# Altium project DroneProject.PrjPCB
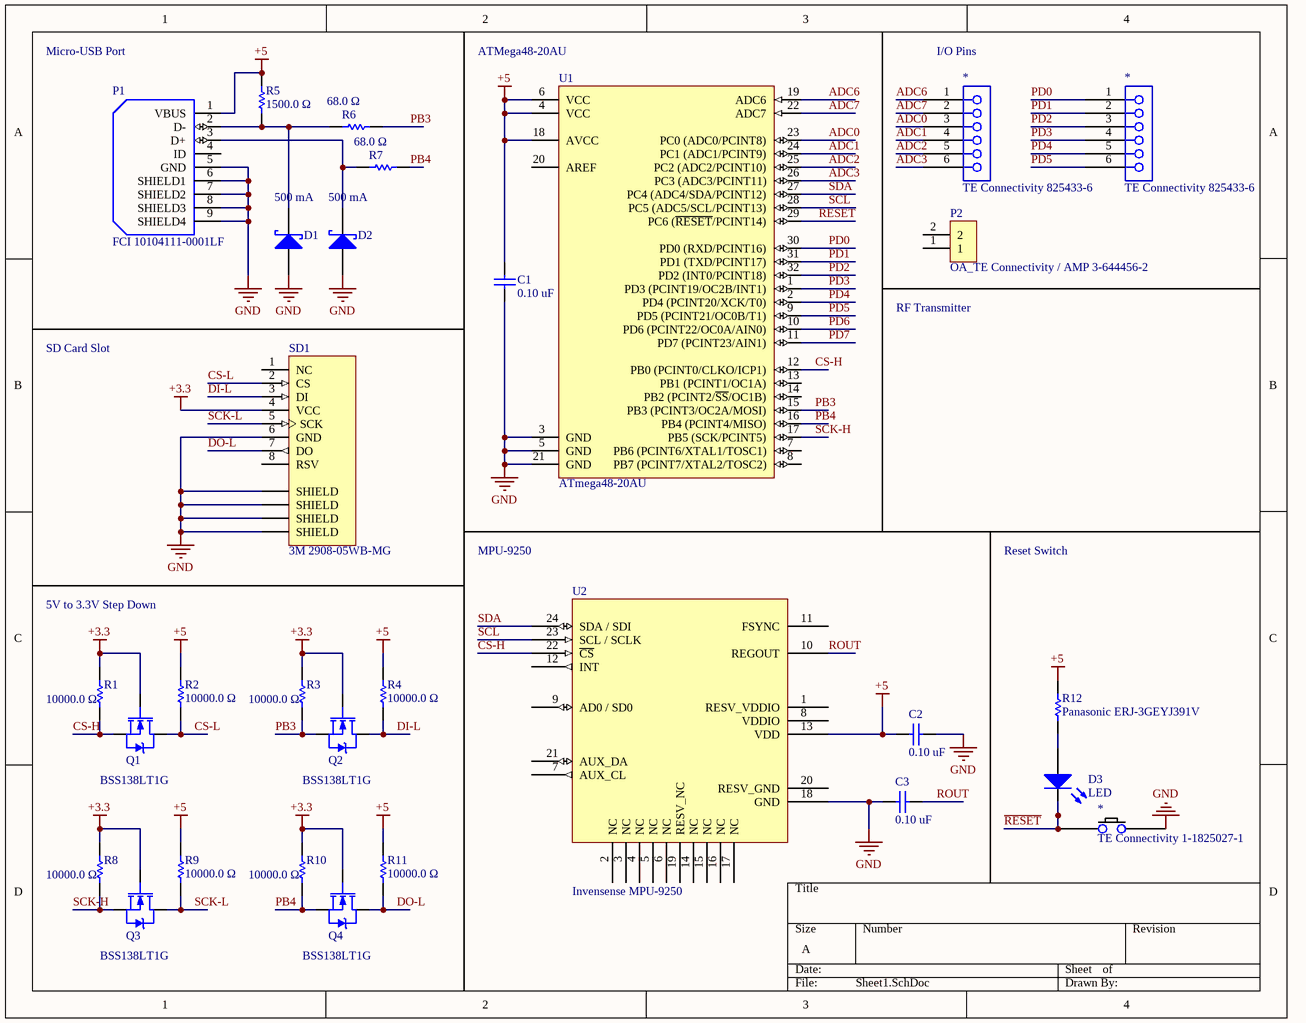
[diagram p0: Sheet1.SchDoc]
1 sheet, 30 parts. Net scope: global (net labels, ports and power ports of the same name join across sheets).
Board file: PCB1.PcbDoc

## Sheet Sheet1.SchDoc
size A

### Parts
(Parts that share a designator on the sheet are numbered #1, #2 ... from top to bottom, then left to right.)
*#1  TE Connectivity 825433-6  [PCB-2xrknp0frdgvb29ud8aa-1]
*#2  TE Connectivity 825433-6  [PCB-2xrknp0frdgvb29ud8aa-1]
*#3  TE Connectivity 1-1825027-1  [PCB-z0tn1x4l8qb5b43a6q2n-1]
C1  Capacitance: 0.10 uF  [CAPC1608X90X35NL15T15]  (hidden comment: AVX Interconnect / Elco 0603YC104JAT2A)
C2  Capacitance: 0.10 uF  [CAPC1608X90X35NL15T15]  (hidden comment: AVX Interconnect / Elco 0603YC104JAT2A)
C3  Capacitance: 0.10 uF  [CAPC1608X90X35NL15T15]  (hidden comment: AVX Interconnect / Elco 0603YC104JAT2A)
D1  Current Rating: 500 mA  [PCB-6tqbiewd2diqb4h5r69p-1]  (hidden comment: Diodes Inc. B0540WS-7)
D2  Current Rating: 500 mA  [PCB-6tqbiewd2diqb4h5r69p-1]  (hidden comment: Diodes Inc. B0540WS-7)
D3  LED  [PCB-rv0a2x7hhpgrq2idocfg-1]
P1  FCI 10104111-0001LF  [FCI-USB-4SHLD_AP8604]
P2  OA_TE Connectivity / AMP 3-644456-2  [PCB-5yupddsicqn8qq7gr5lb-1]
Q1  Manufacturer Part Number: BSS138LT1G  [SOT23-3_B]  (hidden comment: ON Semiconductor BSS138LT1G)
Q2  Manufacturer Part Number: BSS138LT1G  [SOT23-3_B]  (hidden comment: ON Semiconductor BSS138LT1G)
Q3  Manufacturer Part Number: BSS138LT1G  [SOT23-3_B]  (hidden comment: ON Semiconductor BSS138LT1G)
Q4  Manufacturer Part Number: BSS138LT1G  [SOT23-3_B]  (hidden comment: ON Semiconductor BSS138LT1G)
R1  Resistance: 10000.0 Ω  [RESC1609X50X30ML10T20]  (hidden comment: Vishay Dale CRCW060310K0FKEB)
R2  Resistance: 10000.0 Ω  [RESC1609X50X30ML10T20]  (hidden comment: Vishay Dale CRCW060310K0FKEB)
R3  Resistance: 10000.0 Ω  [RESC1609X50X30ML10T20]  (hidden comment: Vishay Dale CRCW060310K0FKEB)
R4  Resistance: 10000.0 Ω  [RESC1609X50X30ML10T20]  (hidden comment: Vishay Dale CRCW060310K0FKEB)
R5  Resistance: 1500.0 Ω  [RESC1609X50X30LL10T20]  (hidden comment: Vishay Dale CRCW06031K50JNEA)
R6  Resistance: 68.0 Ω  [RESC1608X55X30LL15T15]  (hidden comment: Panasonic ERJ-3GEYJ680V)
R7  Resistance: 68.0 Ω  [RESC1608X55X30LL15T15]  (hidden comment: Panasonic ERJ-3GEYJ680V)
R8  Resistance: 10000.0 Ω  [RESC1609X50X30ML10T20]  (hidden comment: Vishay Dale CRCW060310K0FKEB)
R9  Resistance: 10000.0 Ω  [RESC1609X50X30ML10T20]  (hidden comment: Vishay Dale CRCW060310K0FKEB)
R10  Resistance: 10000.0 Ω  [RESC1609X50X30ML10T20]  (hidden comment: Vishay Dale CRCW060310K0FKEB)
R11  Resistance: 10000.0 Ω  [RESC1609X50X30ML10T20]  (hidden comment: Vishay Dale CRCW060310K0FKEB)
R12  Panasonic ERJ-3GEYJ391V  [RESC1608X55X30LL15T15]
SD1  3M 2908-05WB-MG  [MICRO-SD-SOCKET-PP]
U1  ATmega48-20AU  [32A_L]
U2  Invensense MPU-9250  [PCB-14871381-2]

### Nets
+3.3: Q1.1(G) Q2.1(G) Q3.1(G) Q4.1(G) R1.2 R3.2 R8.2 R10.2 SD1.4(VCC)
+5: C1.2 C2.2 P1.1(VBUS) R2.2 R4.2 R5.2 R9.2 R11.2 R12.2 U1.4(VCC) U1.6(VCC) U1.18(AVCC) U2.13(VDD)
GND: *#3.2 C1.1 C2.1 C3.1 D1.2(A) D2.2(A) P1.5(GND) P1.6(SHIELD1) P1.7(SHIELD2) P1.8(SHIELD3) P1.9(SHIELD4) SD1.6(GND) SD1.CD1(SHIELD) SD1.CD2(SHIELD) SD1.GND1(SHIELD) SD1.GND3(SHIELD) U1.3(GND) U1.5(GND) U1.21(GND) U2.18(GND)
ADC0: *#1.3 U1.23(PC0_(ADC0/PCINT8))
ADC1: *#1.4 U1.24(PC1_(ADC1/PCINT9))
ADC2: *#1.5 U1.25(PC2_(ADC2/PCINT10))
ADC3: *#1.6 U1.26(PC3_(ADC3/PCINT11))
ADC6: *#1.1 U1.19(ADC6)
ADC7: *#1.2 U1.22(ADC7)
CS-H: Q1.2(S) R1.1 U1.12(PB0_(PCINT0/CLKO/ICP1)) U2.22(~{CS})
CS-L: Q1.3(D) R2.1 SD1.2(CS)
DI-L: Q2.3(D) R4.1 SD1.3(DI)
DO-L: Q4.3(D) R11.1 SD1.7(DO)
PB3: Q2.2(S) R3.1 R6.2 U1.15(PB3_(PCINT3/OC2A/MOSI))
PB4: Q4.2(S) R7.2 R10.1 U1.16(PB4_(PCINT4/MISO))
PD0: *#2.1 U1.30(PD0_(RXD/PCINT16))
PD1: *#2.2 U1.31(PD1_(TXD/PCINT17))
PD2: *#2.3 U1.32(PD2_(INT0/PCINT18))
PD3: *#2.4 U1.1(PD3_(PCINT19/OC2B/INT1))
PD4: *#2.5 U1.2(PD4_(PCINT20/XCK/T0))
PD5: *#2.6 U1.9(PD5_(PCINT21/OC0B/T1))
PD6: U1.10(PD6_(PCINT22/OC0A/AIN0))
PD7: U1.11(PD7_(PCINT23/AIN1))
~{RESET}: *#3.1 D3.2(K) U1.29(PC6_(~{RESET}/PCINT14))
ROUT: C3.2 U2.10(REGOUT)
SCK-H: Q3.2(S) R8.1 U1.17(PB5_(SCK/PCINT5))
SCK-L: Q3.3(D) R9.1 SD1.5(SCK)
SCL: U1.28(PC5_(ADC5/SCL/PCINT13)) U2.23(SCL_/_SCLK)
SDA: U1.27(PC4_(ADC4/SDA/PCINT12)) U2.24(SDA_/_SDI)
NetD1_1: D1.1(K) P1.2(D-) R5.1 R6.1
NetD2_1: D2.1(K) P1.3(D+) R7.1
NetD3_1: D3.1(A) R12.1

Not connected (* = marked no-connect by the designer): P1 4(ID); P2 1 2; SD1 1(NC) 8(RSV); U1 7(PB6_(PCINT6/XTAL1/TOSC1)) 8(PB7_(PCINT7/XTAL2/TOSC2)) 13(PB1_(PCINT1/OC1A)) 14(PB2_(PCINT2/~{SS}/OC1B)) 20(AREF); U2 1(RESV_VDDIO) 2(NC) 3(NC) 4(NC) 5(NC) 6(NC) 7(AUX_CL) 8(VDDIO) 9(AD0_/_SD0) 11(FSYNC) 12(INT) 14(NC) 15(NC) 16(NC) 17(NC) 19(RESV_NC) 20(RESV_GND) 21(AUX_DA)

### Notes on the sheet
- Micro-USB Port
- (near U1) ATMega48-20AU
- (near *#1) I/O Pins
- SD Card Slot
- RF Transmitter
- MPU-9250
- Reset Switch
- 5V to 3.3V Step Down

### Library data of the parts
*#1 *#2 = 825433-6: Conn Unshrouded Header HDR 6 POS 2.54mm Solder ST Thru-Hole; Pin Pitch: 0.00254 m; Current Rating: 3.0 A; Number of Contacts: 6; ELV Compliant: Compliant; Gender: Male; Housing Color: Green; Contact Plating: Gold, Gold over Nickel, Tin, Tin over Nickel; Mounting Style: PCB; Orientation: Vertical; Packaging: Box; Housing Material: Polyester; RoHS: Compliant; REACH SVHC Compliance: No SVHC; Flammability Rating: UL 94 V-0; Contact Material: Brass; Manufacturer Part Number: 825433-6; OctopartID: 88ed4362af17572a; Lifecycle Status: Active; Octopart URL: http://octopart.com/825433-6-te+connectivity-42271388
*#3 = 1-1825027-1: Switch Push Button OFF (ON) SPST Round Button 0.05A 24VDC Momentary Contact PC Pins Thru-Hole; ELV Compliant: Compliant; Lead-Free Status: Lead Free; Mounting Style: Through Hole; Packaging: Bag; Manufacturer Part Number: 1-1825027-1; Octopart URL: http://octopart.com/1-1825027-1-te+connectivity-42270326; Lifecycle Status: Active; RoHS: Compliant; OctopartID: 4d86860896969241; Contact Material: Copper Alloy
C1-C3 = CMP-19299424-3: CAP CER 0.1UF 16V 5% X7R 0603; Dielectric Material: Ceramic Multilayer; Lead-Free Status: Lead Free; Voltage Rating (DC): 16.0 V; Insulation Resistance: 1e+11 Ω; REACH SVHC Compliance: No SVHC; Mounting Style: Surface Mount; Number of Pins: 2; Size-Width: 0.0008128 m; RoHS: Compliant; Size-Height: 0.00086 m; Case/Package: 0603; Size-Length: 0.0016002 m; Octopart Url: https://octopart.com/0603yc104jat2a-avx+interconnect+%2F+elco-39513099; Capacitance Tolerance: ±5%; OctopartID: 520599559b688dc2; Dielectric Characteristic: X7R
D1 D2 = CMP-992e5020441546e9-1: B0540WS Series 40 V 0.5 A Schottky Barrier Rectifier Surface Mount - SOD-323; Lead-Free Status: Lead Free; Output Current: 500 mA (max); Polarity: Standard; Voltage Rating (DC): 40.0 V; Capacitance: 125 pF; Mounting Style: Surface Mount; Octopart URL: http://octopart.com/b0540ws-7-diodes+inc.-325725; Case/Package: SOD-323; Packaging: Cut Tape (CT), Tape & Reel (TR); RoHS: Compliant; Number of Pins: 2; Manufacturer Part Number: B0540WS-7; Lifecycle Status: Active; REACH SVHC Compliance: No SVHC; OctopartID: 992e5020441546e9
D3 = HSMH-C170: LED; SMD; 0805; red; 7.2-17mcd; 2x1.25x0.8mm; 170°; 1.8÷2.6V; 20mA
P1 = 10104111-0001LF: Conn USB Type A/B RCP 5 POS 0.65mm Solder RA SMD 5 Terminal 1 Port T/R; Gender: Female; Number of Contacts: 5; OctopartID: c7b40fa1d6b01873; Mounting Style: Surface Mount; Seller Landing  Url: https://octopart-clicks.com/click/track?country=US&ak=8157f166&sig=0e93c97&sid=5489&ppid=18822242&vpid=43983423&ct=offers; Contact Plating: Gold; Orientation: Right Angle; REACH SVHC Compliance: No SVHC; Contact Material: Copper Alloy; Octopart Url: http://octopart.com/10104111-0001lf-fci-18822242; RoHS: Compliant; Manufacturer Part Number: 10104111-0001LF
P2 = 3-644456-2: Connector Unshrouded Header HDR 2 Position 2.54mm Solder Straight Thru-Hole; Voltage Rating (AC): 250 V; ELV Compliant: Compliant; Lead-Free Status: Lead Free; Number of Positions: 2; Mounting Angle: 180 °; Gender: Male; Shrouded: No; Octopart URL: http://octopart.com/3-644456-2-te+connectivity+%2F+amp-39514699; Contact Material: Copper Alloy; Housing Material: Polyester; Contact Plating: Tin; RoHS: Compliant; Lifecycle Status: Active; OctopartID: c1ea0aba16c71e2d; Pin Pitch: 2.54 mm; Size-Width: 2.34 mm; Number of Rows: 1; Number of Contacts: 2; Manufacturer Part Number: 3-644456-2; Size-Height: 2.54 mm; Housing Color: Natural; Mounting Style: Through Hole; Size-Length: 4.78 mm; Flammability Rating: UL 94 V-0; Packaging: Box, Bag; Orientation: Vertical
Q1-Q4 = CMP-830104-18: BSS138L: Small Signal MOSFET 50V 200mA 3.5 Ohm Single N-Channel SOT-23 Logic Level; Drain to Source Voltage (Vds): 50.0 V; Breakdown Voltage [Gate to Source]: -20.0 V to 20.0 V; Power Dissipation: 225 mW; Input Capacitance: 50.0 pF; Drain to Source Resistance (on) (Rds): 3.50 Ω; Lead-Free Status: Lead Free; Seller Landing  Url: https://octopart-clicks.com/click/track?country=US&ak=8157f166&sig=018e50f&sid=2402&ppid=5035&vpid=22035692&ct=offers; Packaging: Tape & Reel (TR), Cut Tape (CT); Octopart Url: http://octopart.com/bss138lt1g-on+semiconductor-5035; Lifecycle Status: Active; Current Rating: 200 mA; Voltage Rating (DC): 50.0 V; Number of Pins: 3; REACH SVHC Compliance: No SVHC; Breakdown Voltage (Drain to Source): 50.0 V; Continuous Drain Current (Ids): 200 mA; Mounting Style: Surface Mount; Case/Package: SOT-23; OctopartID: 1270db7a24bdcdb7; Polarity: N-Channel; RoHS: Compliant; Halogen Free Status: Halogen Free
R1-R4 R8-R11 = CMP-2823404-2: Res Thick Film 0603 10K Ohm 1% 0.1W(1/10W) ±100ppm/C Molded SMD Automotive Paper T/R; Lead-Free Status: Lead Free; Voltage Rating (DC): 75.0 V; Case/Package: 0603; Number of Pins: 2; Octopart Url: https://octopart.com/crcw060310k0fkeb-vishay-42465018; OctopartID: a8d6635b7b4a7711; Packaging: Cut Tape (CT); Power Rating: 0.1 W; Resistance Tolerance: ±1%; RoHS: Compliant
R5 = CMP-1856103-2: RES SMD 1.5K OHM 5% 1/10W 0603; Lead-Free Status: Lead Free; Power Rating: 0.1 W; Temperature Coefficient: 200.0 ppm/°C; Voltage Rating (DC): 75.0 V; Case/Package: 0603; Mounting Style: Surface Mount; Number of Pins: 2; Octopart Url: https://octopart.com/crcw06031k50jnea-vishay-39435173; OctopartID: 26f3eda0b830f934; Packaging: Cut Tape (CT); Resistance Tolerance: ±5%; RoHS: Compliant; Size-Height: 0.00045 m; Size-Length: 0.00155 m; Size-Width: 0.00085 m
R6 R7 = CMP-3708367-2: RES SMD 68 OHM 5% 1/10W 0603; Lead-Free Status: Lead Free; Power Rating: 0.1 W; Voltage Rating (DC): 75.0 V; Case/Package: 0603; Lifecycle Status: Not Listed by Manufacturer; Mounting Style: Surface Mount; Octopart Url: https://octopart.com/erj-3geyj680v-panasonic-55422139; OctopartID: a4166e512dcb7bd1; Packaging: Cut Tape (CT); REACH SVHC Compliance: No SVHC; Resistance Tolerance: ±5%; RoHS: Compliant; Size-Height: 0.00045 m; Size-Length: 0.0016 m; Size-Width: 0.0008 m
R12 = ERJ-3GEYJ391V: Thick Film Resistors - SMD 0603 390ohms 5% Tol; Lead-Free Status: Lead Free; Power Rating: 0.1 W; Resistance: 390.0 Ω; Voltage Rating (DC): 75.0 V; Case/Package: 0603; Lifecycle Status: Not Listed by Manufacturer; Mounting Style: Surface Mount; Octopart Url: https://octopart.com/erj-3geyj391v-panasonic-55422096; OctopartID: bc667621359063a1; Packaging: Cut Tape (CT); REACH SVHC Compliance: No SVHC; Resistance Tolerance: ±5%; RoHS: Compliant; Size-Height: 0.00045 m; Size-Length: 0.0016 m; Size-Width: 0.0008 m
SD1 = 2908-05WB-MG: CONN EJECT MICROSD PUSH-PUSH SMD; Lead-Free Status: Lead Free; Number of Contacts: 8; Pin Pitch: 0.0010922 m; Contact Material: Copper; Mounting Style: Surface Mount; Number of Positions: 8; Octopart Url: https://octopart.com/2908-05wb-mg-3m-655983; OctopartID: 2fa0e6a008a9f067; Packaging: Cut Tape (CT); REACH SVHC Compliance: No SVHC; RoHS: Compliant; Size-Height: 0.00185 m; Size-Length: 0.00185 m; Size-Width: 0.014 m
U1 = ATMEGA48-20AU: 8-bit AVR Microcontroller, 2.7-5.5V, 20MHz, 4KB Flash, 256 Bytes EEPROM, 512 Bytes SRAM, 32-pin TQFP, Industrial Grade (-40°C to 85°C); Access Time: 2e-05 s; Clock Speed: 20000000.0 Hz; FLASH Memory Size: 4096 B; Lead-Free Status: Lead Free; Number of Bits: 8; Number of I/O Pins: 23; RAM Memory Size: 512 B; Supply Voltage (DC): 5.0 V; Case/Package: TQFP; Core Architecture: AVR; Mounting Style: Surface Mount; Number of Pins: 32; Octopart Url: https://octopart.com/atmega48-20au-atmel-39961890; OctopartID: 54339f58b4778bf4; REACH SVHC Compliance: No SVHC; RoHS: Compliant
U2 = MPU-9250: GYRO/ACCEL/COMPASS/9-AXIS; Octopart Url: https://octopart.com/mpu-9250-invensense-33342822; RoHS: Compliant; OctopartID: beb076465eb06177